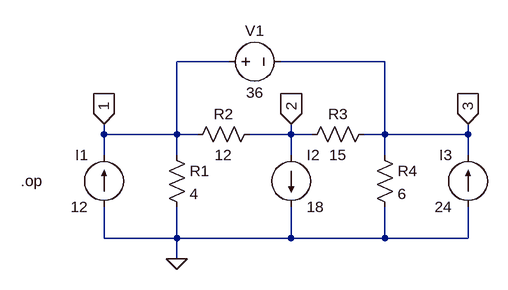
[diagram p0: schematic Super-node.asc]
Super-node.asc, the LTspice schematic file:
Version 4
SHEET 1 880 680
WIRE 192 -16 112 -16
WIRE 432 -16 272 -16
WIRE 0 96 0 80
WIRE 112 96 112 -16
WIRE 112 96 0 96
WIRE 144 96 112 96
WIRE 288 96 288 80
WIRE 288 96 224 96
WIRE 320 96 288 96
WIRE 432 96 432 -16
WIRE 432 96 400 96
WIRE 560 96 560 80
WIRE 560 96 432 96
WIRE 0 128 0 96
WIRE 112 128 112 96
WIRE 288 128 288 96
WIRE 432 128 432 96
WIRE 560 128 560 96
WIRE 0 256 0 208
WIRE 112 256 112 208
WIRE 112 256 0 256
WIRE 288 256 288 208
WIRE 288 256 112 256
WIRE 432 256 432 208
WIRE 432 256 288 256
WIRE 560 256 560 208
WIRE 560 256 432 256
WIRE 112 288 112 256
FLAG 0 80 1
IOPIN 0 80 In
FLAG 288 80 2
IOPIN 288 80 In
FLAG 560 80 3
IOPIN 560 80 In
FLAG 112 288 0
SYMBOL voltage 176 -16 R270
WINDOW 0 32 56 VTop 2
WINDOW 3 -32 56 VBottom 2
SYMATTR InstName V1
SYMATTR Value 36
SYMBOL current 0 208 R180
WINDOW 0 24 80 Left 2
WINDOW 3 24 0 Left 2
SYMATTR InstName I1
SYMATTR Value 12
SYMBOL current 288 128 R0
SYMATTR InstName I2
SYMATTR Value 18
SYMBOL current 560 208 R180
WINDOW 0 24 80 Left 2
WINDOW 3 24 0 Left 2
SYMATTR InstName I3
SYMATTR Value 24
SYMBOL res 96 112 R0
SYMATTR InstName R1
SYMATTR Value 4
SYMBOL res 416 112 R0
SYMATTR InstName R4
SYMATTR Value 6
SYMBOL res 240 80 R90
WINDOW 0 0 56 VBottom 2
WINDOW 3 32 56 VTop 2
SYMATTR InstName R2
SYMATTR Value 12
SYMBOL res 416 80 R90
WINDOW 0 0 56 VBottom 2
WINDOW 3 32 56 VTop 2
SYMATTR InstName R3
SYMATTR Value 15
TEXT -128 168 Left 2 !.op

The netlist it stands for:
* Super-node.asc
V1 1 3 36
I1 0 1 12
I2 2 0 18
I3 0 3 24
R1 1 0 4
R4 3 0 6
R2 2 1 12
R3 3 2 15
.op
.backanno
.end